# Altium schematic sheet EVK-IRIS-W1-FTDI.SchDoc
size A3; DocumentNumber: 9; SheetNumber: 9; SheetTotal: 14
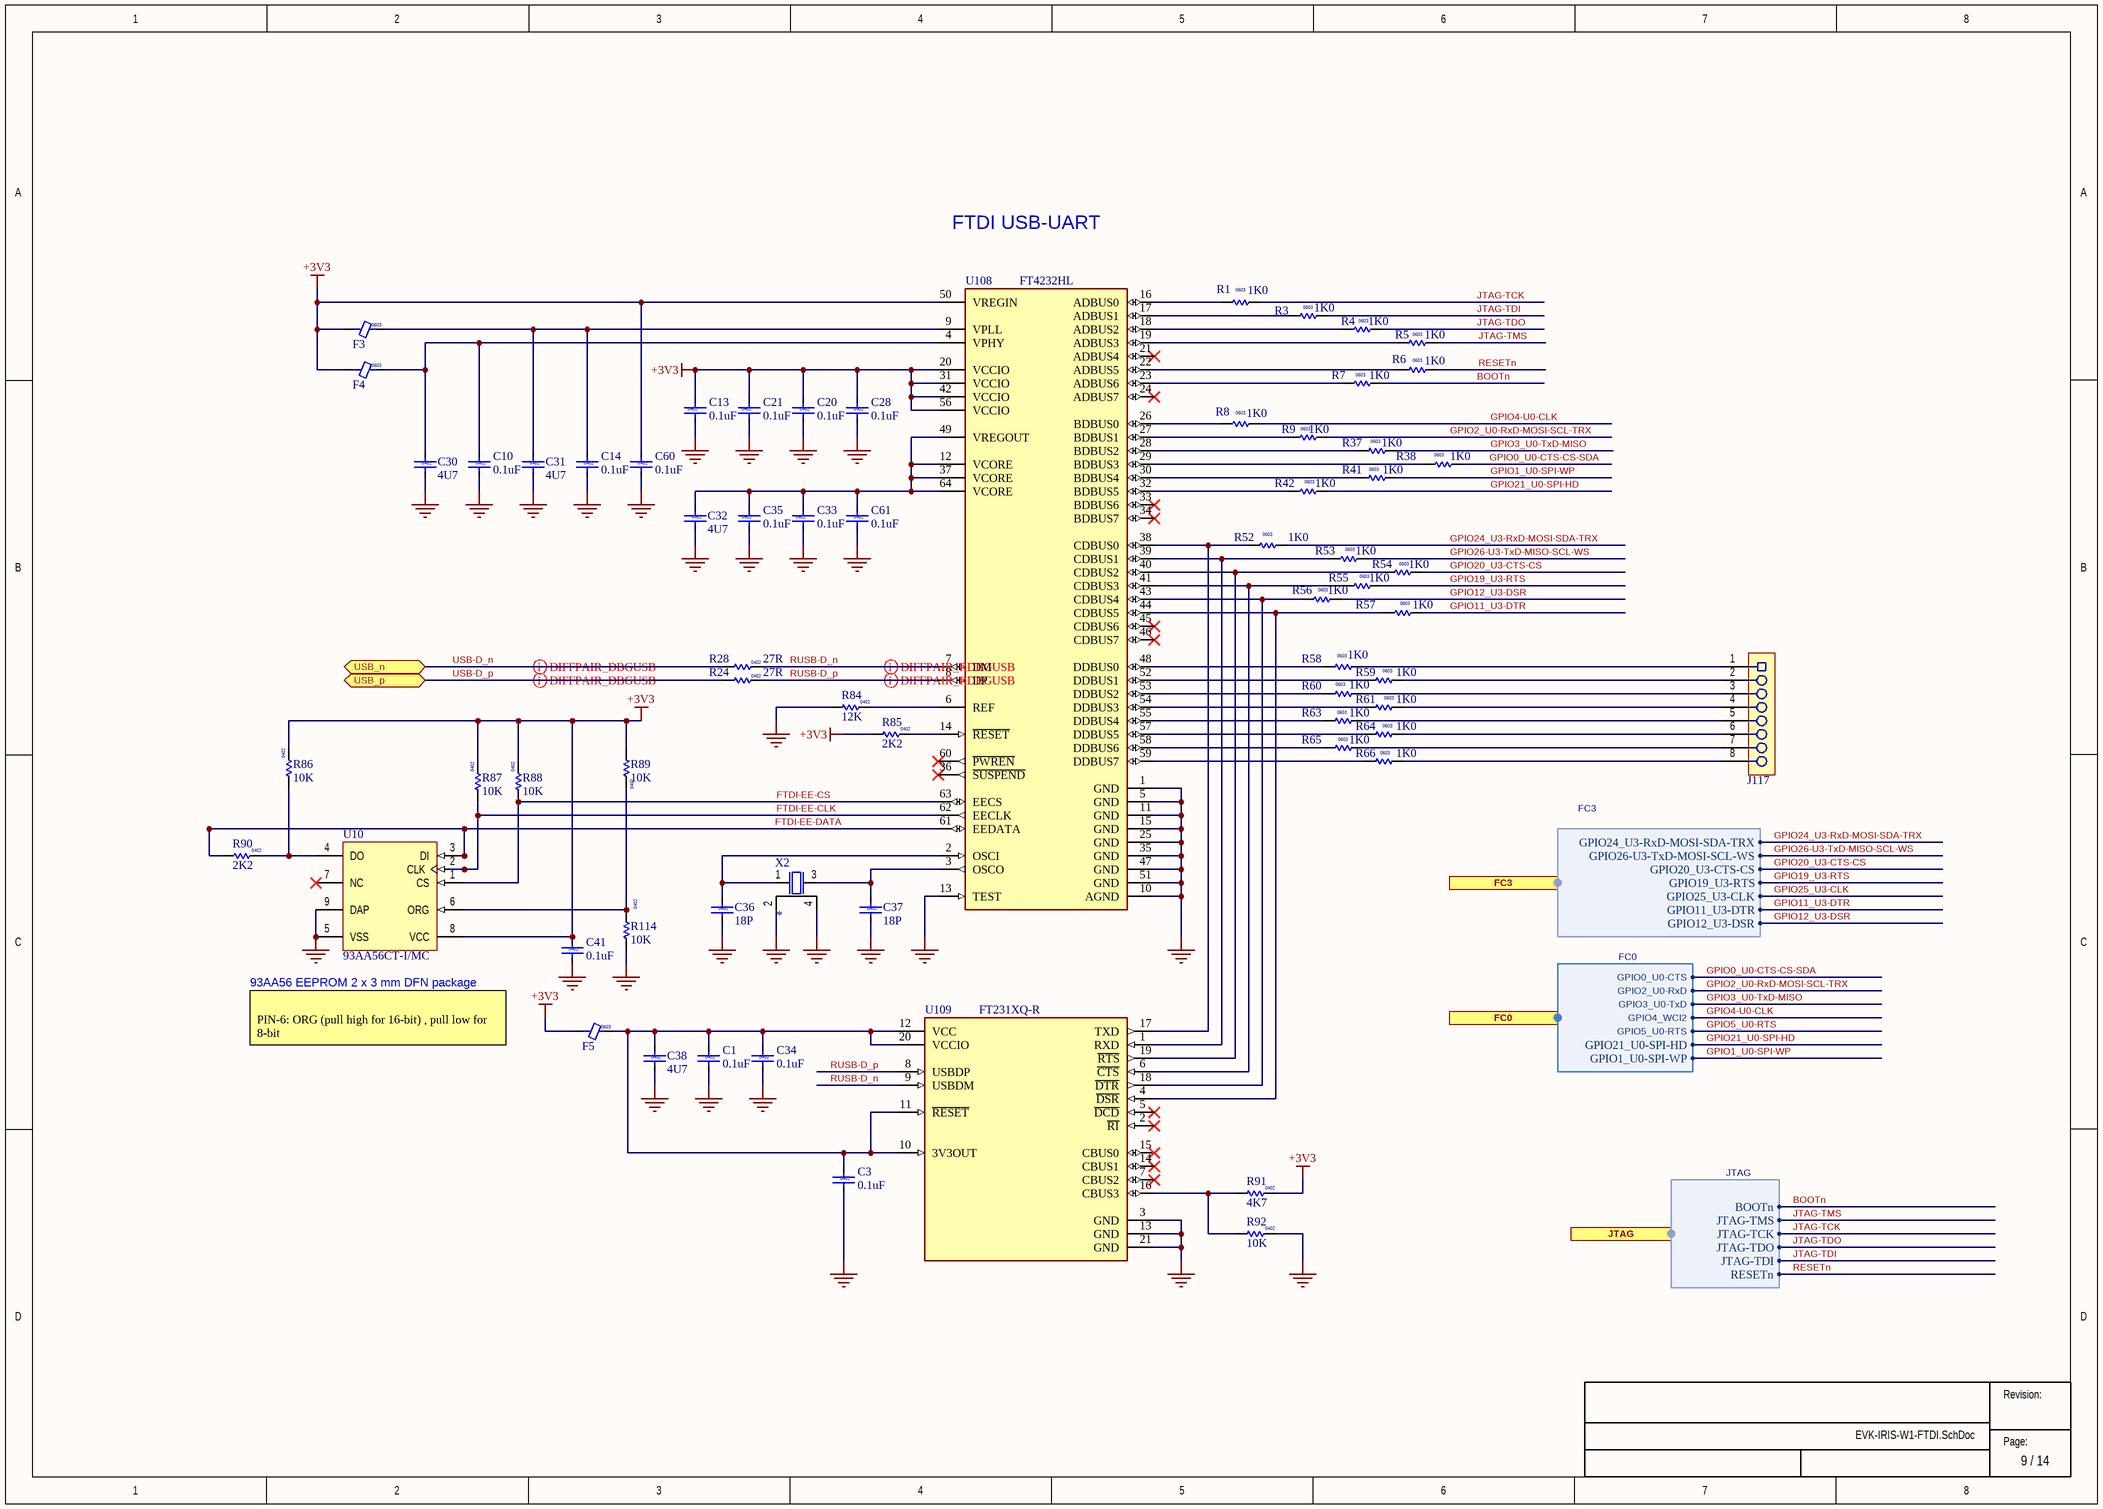
[diagram p0: EVK-IRIS-W1-FTDI.SchDoc]

## Parts
C1  value 0.1uF  Size: 0402  [Cap 0402 HD]
C3  value 0.1uF  Size: 0402  [Cap 0402 HD]
C10  value 0.1uF  Size: 0402  [Cap 0402 HD]
C13  value 0.1uF  Size: 0402  [Cap 0402 HD]
C14  value 0.1uF  Size: 0402  [Cap 0402 HD]
C20  value 0.1uF  Size: 0402  [Cap 0402 HD]
C21  value 0.1uF  Size: 0402  [Cap 0402 HD]
C28  value 0.1uF  Size: 0402  [Cap 0402 HD]
C30  value 4U7  Size: 0402  [Cap 0402 HD]
C31  value 4U7  Size: 0402  [Cap 0402 HD]
C32  value 4U7  Size: 0402  [Cap 0402 HD]
C33  value 0.1uF  Size: 0402  [Cap 0402 HD]
C34  value 0.1uF  Size: 0402  [Cap 0402 HD]
C35  value 0.1uF  Size: 0402  [Cap 0402 HD]
C36  value 18P  Size: 0402  [Cap 0402]
C37  value 18P  Size: 0402  [Cap 0402]
C38  value 4U7  Size: 0402  [Cap 0402 HD]
C41  value 0.1uF  Size: 0402  [Cap 0402 HD]
C60  value 0.1uF  Size: 0402  [Cap 0402 HD]
C61  value 0.1uF  Size: 0402  [Cap 0402 HD]
F3  Size: 0603  [IND 0603 HD]
F4  Size: 0603  [IND 0603 HD]
F5  Size: 0603  [IND 0603 HD]
J117  (no value)  [SKT-0.1P-SSM-108-L-SV]
R1  value 1K0  Size: 0603  [RES 0603 HD]
R3  value 1K0  Size: 0603  [RES 0603 HD]
R4  value 1K0  Size: 0603  [RES 0603 HD]
R5  value 1K0  Size: 0603  [RES 0603 HD]
R6  value 1K0  Size: 0603  [RES 0603 HD]
R7  value 1K0  Size: 0603  [RES 0603 HD]
R8  value 1K0  Size: 0603  [RES 0603 HD]
R9  value 1K0  Size: 0603  [RES 0603 HD]
R24  value 27R  Size: 0402  [RES 0402 HD]
R28  value 27R  Size: 0402  [RES 0402 HD]
R37  value 1K0  Size: 0603  [RES 0603 HD]
R38  value 1K0  Size: 0603  [RES 0603 HD]
R41  value 1K0  Size: 0603  [RES 0603 HD]
R42  value 1K0  Size: 0603  [RES 0603 HD]
R52  value 1K0  Size: 0603  [RES 0603 HD]
R53  value 1K0  Size: 0603  [RES 0603 HD]
R54  value 1K0  Size: 0603  [RES 0603 HD]
R55  value 1K0  Size: 0603  [RES 0603 HD]
R56  value 1K0  Size: 0603  [RES 0603 HD]
R57  value 1K0  Size: 0603  [RES 0603 HD]
R58  value 1K0  Size: 0603  [RES 0603 HD]
R59  value 1K0  Size: 0603  [RES 0603 HD]
R60  value 1K0  Size: 0603  [RES 0603 HD]
R61  value 1K0  Size: 0603  [RES 0603 HD]
R63  value 1K0  Size: 0603  [RES 0603 HD]
R64  value 1K0  Size: 0603  [RES 0603 HD]
R65  value 1K0  Size: 0603  [RES 0603 HD]
R66  value 1K0  Size: 0603  [RES 0603 HD]
R84  value 12K  Size: 0402  [RES 0402 HD]
R85  value 2K2  Size: 0402  [RES 0402 HD]
R86  value 10K  Size: 0402  [RES 0402 HD]
R87  value 10K  Size: 0402  [RES 0402 HD]
R88  value 10K  Size: 0402  [RES 0402 HD]
R89  value 10K  Size: 0402  [RES 0402 HD]
R90  value 2K2  Size: 0402  [RES 0402 HD]
R91  value 4K7  Size: 0402  [RES 0402 HD]
R92  value 10K  Size: 0402  [RES 0402 HD]
R114  value 10K  Size: 0402  [RES 0402 HD]
U10  93AA56CT-I/MC  [DFN-MC8]
U108  FT4232HL  [QFP0.5P16x16-64Pin_HD]
U109  FT231XQ-R  [QFN_5x5_FT231XQ]
X2  (no value)  [XTAL_3225]

## Ports
FC0 (harness FC0), FC3 (harness FC3), JTAG (harness JTAG), USB_n (bidir), USB_p (bidir)

## Harnesses
JTAG: JTAG-TCK, JTAG-TDI, JTAG-TDO, JTAG-TMS, RESETn, BOOTn
FC3: GPIO20_U3-CTS-CS, GPIO19_U3-RTS, GPIO24_U3-RxD-MOSI-SDA-TRX, GPIO26-U3-TxD-MOSI-SCL-WS, GPIO25_U3-CLK, GPIO11_U3-DTR, GPIO12_U3-DSR
FC0: GPIO0_U0-CTS, GPIO2_U0-RxD, GPIO3_U0-TxD, GPIO5_U0-RTS, GPIO4_WCI2, GPIO21_U0-SPI-HD, GPIO1_U0-SPI-WP

## Nets
+3V3: C13.1 C20.1 C21.1 C28.1 C41.1 C60.1 F3.1 F4.1 F5.1 R85.1 R86.2 R87.2 R88.2 R89.1 R91.2 U10.8(VCC) U108.20(VCCIO) U108.31(VCCIO) U108.42(VCCIO) U108.50(VREGIN) U108.56(VCCIO)
GND: C1.2 C3.2 C10.2 C13.2 C14.2 C20.2 C21.2 C28.2 C30.2 C31.2 C32.2 C33.2 C34.2 C35.2 C36.2 C37.2 C38.2 C41.2 C60.2 C61.2 R84.1 R92.2 R114.1 U10.5(VSS) U10.9(DAP) U108.1(GND) U108.5(GND) U108.10(AGND) U108.11(GND) U108.13(TEST) U108.15(GND) U108.25(GND) U108.35(GND) U108.47(GND) U108.51(GND) U109.3(GND) U109.13(GND) U109.21(GND) X2.2 X2.4
BOOTn: R7.2 ; port JTAG.BOOTn
FTDI-EE-CLK: R87.1 U10.2(CLK) U108.62(EECLK)
FTDI-EE-CS: R88.1 U10.1(CS) U108.63(EECS)
FTDI-EE-DATA: R90.1 U10.3(DI) U108.61(EEDATA)
GPIO0_U0-CTS-CS-SDA: R38.2 ; port FC0.GPIO0_U0-CTS
GPIO1_U0-SPI-WP: R41.2 ; port FC0.GPIO1_U0-SPI-WP
GPIO2_U0-RxD-MOSI-SCL-TRX: R9.2 ; port FC0.GPIO2_U0-RxD
GPIO3_U0-TxD-MISO: R37.2 ; port FC0.GPIO3_U0-TxD
GPIO4-U0-CLK: R8.2 ; port FC0.GPIO4_WCI2
GPIO11_U3-DTR: R57.2 ; port FC3.GPIO11_U3-DTR
GPIO12_U3-DSR: R56.2 ; port FC3.GPIO12_U3-DSR
GPIO19_U3-RTS: R55.2 ; port FC3.GPIO19_U3-RTS
GPIO20_U3-CTS-CS: R54.2 ; port FC3.GPIO20_U3-CTS-CS
GPIO21_U0-SPI-HD: R42.2 ; port FC0.GPIO21_U0-SPI-HD
GPIO24_U3-RxD-MOSI-SDA-TRX: R52.2 ; port FC3.GPIO24_U3-RxD-MOSI-SDA-TRX
GPIO25_U3-CLK: port FC3.GPIO25_U3-CLK
GPIO26-U3-TxD-MISO-SCL-WS: R53.2 ; port FC3.GPIO26-U3-TxD-MOSI-SCL-WS
JTAG-TCK: R1.2 ; port JTAG.JTAG-TCK
JTAG-TDI: R3.2 ; port JTAG.JTAG-TDI
JTAG-TDO: R4.2 ; port JTAG.JTAG-TDO
JTAG-TMS: R5.2 ; port JTAG.JTAG-TMS
RESETn: R6.2 ; port JTAG.RESETn
RUSB-D_n: R28.1 U108.7(DM) U109.9(USBDM)
RUSB-D_p: R24.1 U108.8(DP) U109.8(USBDP)
USB-D_n: R28.2 ; port USB_n
USB-D_p: R24.2 ; port USB_p
NetC1_1: C1.1 C3.1 C34.1 C38.1 F5.2 U109.10(3V3OUT) U109.11(~{RESET}) U109.12(VCC) U109.20(VCCIO)
NetC10_1: C10.1 C30.1 F4.2 U108.4(VPHY)
NetC14_1: C14.1 C31.1 F3.2 U108.9(VPLL)
NetC32_1: C32.1 C33.1 C35.1 C61.1 U108.12(VCORE) U108.37(VCORE) U108.49(VREGOUT) U108.64(VCORE)
NetC36_1: C36.1 U108.2(OSCI) X2.1
NetC37_1: C37.1 U108.3(OSCO) X2.3
NetJ117_1: J117.1 R58.2
NetJ117_2: J117.2 R59.2
NetJ117_3: J117.3 R60.2
NetJ117_4: J117.4 R61.2
NetJ117_5: J117.5 R63.2
NetJ117_6: J117.6 R64.2
NetJ117_7: J117.7 R65.2
NetJ117_8: J117.8 R66.2
NetR1_1: R1.1 U108.16(ADBUS0)
NetR3_1: R3.1 U108.17(ADBUS1)
NetR4_1: R4.1 U108.18(ADBUS2)
NetR5_1: R5.1 U108.19(ADBUS3)
NetR6_1: R6.1 U108.22(ADBUS5)
NetR7_1: R7.1 U108.23(ADBUS6)
NetR8_1: R8.1 U108.26(BDBUS0)
NetR9_1: R9.1 U108.27(BDBUS1)
NetR37_1: R37.1 U108.28(BDBUS2)
NetR38_1: R38.1 U108.29(BDBUS3)
NetR41_1: R41.1 U108.30(BDBUS4)
NetR42_1: R42.1 U108.32(BDBUS5)
NetR52_1: R52.1 U108.38(CDBUS0) U109.17(TXD)
NetR53_1: R53.1 U108.39(CDBUS1) U109.1(RXD)
NetR54_1: R54.1 U108.40(CDBUS2) U109.19(~{RTS})
NetR55_1: R55.1 U108.41(CDBUS3) U109.6(~{CTS})
NetR56_1: R56.1 U108.43(CDBUS4) U109.18(~{DTR})
NetR57_1: R57.1 U108.44(CDBUS5) U109.4(~{DSR})
NetR58_1: R58.1 U108.48(DDBUS0)
NetR59_1: R59.1 U108.52(DDBUS1)
NetR60_1: R60.1 U108.53(DDBUS2)
NetR61_1: R61.1 U108.54(DDBUS3)
NetR63_1: R63.1 U108.55(DDBUS4)
NetR64_1: R64.1 U108.57(DDBUS5)
NetR65_1: R65.1 U108.58(DDBUS6)
NetR66_1: R66.1 U108.59(DDBUS7)
NetR84_2: R84.2 U108.6(REF)
NetR85_2: R85.2 U108.14(~{RESET})
NetR86_1: R86.1 R90.2 U10.4(DO)
NetR89_2: R89.2 R114.2 U10.6(ORG)
NetR91_1: R91.1 R92.1 U109.16(CBUS3)

Not connected (* = marked no-connect by the designer): U10 7(NC)*; U108 21(ADBUS4)* 24(ADBUS7)* 33(BDBUS6)* 34(BDBUS7)* 36(~{SUSPEND})* 45(CDBUS6)* 46(CDBUS7)* 60(~{PWREN})*; U109 2(~{RI})* 5(~{DCD})* 7(CBUS2)* 14(CBUS1)* 15(CBUS0)*

## Layout directives
differential pair; differential pair class USB_DIFF; net class USB_DIFF: RUSB-D_n, RUSB-D_p, USB-D_p
differential pair; net class USB_DIFF; differential pair class USB_DIFF: USB-D_n

## Notes on the sheet
- FTDI USB-UART
- (near U10) 93AA56 EEPROM 2 x 3 mm DFN package
- PIN-6: ORG (pull high for 16-bit) , pull low for 8-bit
- Revision:
- Page:

## Library data of the parts
C1 C3 C10 C13 C14 C20 C21 C28 C33-C35 C41 C60 C61 = 120-00016: Cap, Ceramic 0.1uF 10V 10% X5R 0402; Part Name: CAP CER 0.1UF 10V 10% X5R 0402; Manufacturer 1: Murata Electronics North America; Manufacturer Part Number 1: GRM155R61A104KA01J; Tolerance: +/- 10%; Use in new designs: Yes; UBX Code: None; Item Phase: In Production; Part Number: 120-00016; Revision: 0A; Supplier 1: Digi-Key; Supplier Part Number 1: 490-6297-1-ND; Manufacturer 2: Yageo; Supplier 2: Digi-Key; Supplier Part Number 2: 311-1336-1-ND; Height: 0.55mm; Pins: 2; Temperature Coefficient: X5R; Voltage: 10V; Max Operating Temp: 85; Manufacturer Part Number 2: CC0402KRX5R6BB104; Min Operating Temp: -55
C30-C32 C38 = UBXH01-0000243: CAP CER X5R 0402 4U7 20% 10V; Manufacturer: Murata Manufacturing Company, Ltd.; Manufacturer P/N: GRM155R61A475MEAA; Editor: martin.pilik; Released by: fabrice.bret-dibat; Env: GREEN; Permitted Use: Volume Products; Perferred: PREF; Mfg P/N Status: Active; Mfg P/N Split: 100; Mfg P/N Released: Yes; Part Number: UBXH01-0000243; Tolerance: 20%; Max Voltage: 10V; Min Operating Temp: -40°C; Max Operating Temp: 85°C; Part Type: Capacitor; Release Data: 2021-05-10T12:57:47; UBX Wiki: https://wiki.u-blox.com/bin/view/Operations/PartDetails?index=24303; RefDes: C; Mfg P/N Datasheet: https://wiki.u-blox.com/bin/view/Generic/Docs/DocumentSummary?index=24302
C36 C37 = UBXH01-0004017: CAP CER C0G 0402 18P 5% 25V; Manufacturer: Murata Manufacturing Company, Ltd.; Manufacturer P/N: GRM1555C1H180JA01; Editor: doris.zahnd; Released by: daniel.hurni; Env: ROHS; Permitted Use: Volume Products; Perferred: PREF; Mfg P/N Status: NRND; Mfg P/N Split: 100; Mfg P/N Released: Yes; Part Number: UBXH01-0004017; Tolerance: 5%; Max Voltage: 25V; Min Operating Temp: -55°C; Max Operating Temp: 125°C; Part Type: Capacitor; Release Data: 2009-12-03T17:48:42; UBX Wiki: https://wiki.u-blox.com/bin/view/Operations/PartDetails?index=5178; RefDes: C; Manufacturer 2: Murata Manufacturing Company, Ltd.; Manufacturer P/N 2: GRM1555C1E180JZ01; Mfg P/N Status 2: Obsolete; Mfg P/N Split 2: 0; Mfg P/N Released 2: Yes; Manufacturer 3: Murata Manufacturing Company, Ltd.; Manufacturer P/N 3: GRM1555C1H180JZ01; Mfg P/N Status 3: Obsolete; Mfg P/N Split 3: 0; Mfg P/N Released 3: Yes
F3-F5 = UBXH08-0000001: FERRITE BEAD 0603 600 OHM AT 100MHZ 600OHM 500mA; Manufacturer: TDK Corporation; Manufacturer P/N: MMZ1608B601C; Editor: daniel.hurni; Released by: martin.frauchiger; Env: ROHS; Permitted Use: Support Products; Perferred: PREF; Mfg P/N Status: Active; Mfg P/N Split: 100; Mfg P/N Released: Yes; Part Number: UBXH08-0000001; Value: 600OHM; Max Current: 500mA; Min Operating Temp: -40°C; Max Operating Temp: 125°C; Part Type: Ferrite; Release Data: 2009-12-02T10:18:36; UBX Wiki: https://wiki.u-blox.com/bin/view/Operations/PartDetails?index=7960; RefDes: FB; Mfg P/N Datasheet: https://wiki.u-blox.com/bin/view/Generic/Docs/DocumentSummary?index=7941
J117 = 130-00102: Socket Strip 0.1" 8 Pin 1Row SMD Black; Manufacturer 1: Samtec; Manufacturer Part Number 1: SSM-108-F-SV-P-TR; Part Name: CON SKT Strip 0.1" 8Pin 1Row SMD Black; Item Phase: In Production; Use in new designs: Yes; Voltage: 572VDC; UBX Code: None; Part Number: 130-00102; Supplier 1: Avnet; Supplier Part Number 1: SSM-108-F-SV-P-TR; Diameter: None; Height: 7.37mm; Max Operating Temp: 105; Min Operating Temp: -55; Pins: 8; Revision: 0D; Manufacturer 2: Sullins Connector Solutions; Manufacturer Part Number 2: NPPC081KFXC-RC; Supplier 2: Digi-Key; Supplier Part Number 2: S5639-ND
R1 R3-R9 R37 R38 R41 R42 R52-R61 R63-R66 = UBXH18-0000400: RES THICK FILM CHIP 0603 25PPM 1K0 0.1% 100mW; Manufacturer: YAGEO; Manufacturer P/N: RT0603BRD071KL; Editor: martin.kessel; Env: ROHS; Permitted Use: Internal Use; Perferred: PREF; Mfg P/N Status: Active; Mfg P/N Split: 100; Mfg P/N Released: No; Part Number: UBXH18-0000400; Tolerance: 0.1%; Max Power: 100mW; Part Type: Resistor; UBX Wiki: https://wiki.u-blox.com/bin/view/Operations/PartDetails?index=27323; RefDes: R; Min Operating Temp: -55°C; Max Operating Temp: 155°C
R24 R28 = 180-00125: Resistor, 27ohm, 1%, 1/16W, 0402; Part Name: RES SMD 27 OHM 1% 1/16W 0402; Manufacturer 1: Panasonic Electronic Components; Manufacturer Part Number 1: ERJ-2RKF27R0X; Tolerance: +/- 1%; Use in new designs: Yes; UBX Code: None; Item Phase: In Production; Part Number: 180-00125; Supplier 1: Digi-Key; Supplier Part Number 1: P27.0LCT-ND; Height: 0.4mm; Pins: 2; Power: 1/16W; Revision: 0C; Manufacturer 2: Yageo; Supplier 2: Digi-Key; Supplier Part Number 2: YAG3086CT-ND; Max Operating Temp: 155; Voltage: None; Manufacturer Part Number 2: RC0402FR-0727RL; Min Operating Temp: -55
R84 = UBXH18-0000137: RES THICK FILM CHIP 0402 12K 1% 63mW; Manufacturer: Vishay; Manufacturer P/N: CRCW040212K0FKED; Editor: matej.budin; Released by: gabriele.capello; Env: ROHS; Permitted Use: Support Products; Perferred: PREF; Mfg P/N Status: Active; Mfg P/N Split: 100; Mfg P/N Released: Yes; Part Number: UBXH18-0000137; Tolerance: 1%; Max Power: 63mW; Min Operating Temp: -55°C; Max Operating Temp: 125°C; Part Type: Resistor; Release Data: 2014-08-26T10:20:00; UBX Wiki: https://wiki.u-blox.com/bin/view/Operations/PartDetails?index=21075; RefDes: R; Mfg P/N Datasheet: https://wiki.u-blox.com/bin/view/Generic/Docs/DocumentSummary?index=21077
R85 R90 = UBXH18-0008057: RES THICK FILM CHIP 0402 2K2 5% 100mW; Manufacturer: YAGEO; Manufacturer P/N: 2322_705_87222_L; Editor: roland.rust; Env: ROHS; Permitted Use: Volume Products; Perferred: PREF; Mfg P/N Status: NRND; Mfg P/N Split: 100; Mfg P/N Released: Yes; Part Number: UBXH18-0008057; Tolerance: 5%; Max Power: 100mW; Part Type: Resistor; Released by: roland.rust; Release Data: 2007-02-09T10:46:57; UBX Wiki: https://wiki.u-blox.com/bin/view/Operations/PartDetails?index=6956; RefDes: R; Manufacturer 2: YAGEO; Manufacturer P/N 2: RC0402JR-072K2L; Mfg P/N Status 2: Active; Mfg P/N Split 2: 0; Mfg P/N Released 2: Yes; Mfg P/N Datasheet 2: https://wiki.u-blox.com/bin/view/Generic/Docs/DocumentSummary?index=8163
R86-R89 R92 R114 = UBXH18-0008073: RES THICK FILM CHIP 0402 10K 5% 100mW; Manufacturer: KOA; Manufacturer P/N: RK73B1ETTD103J; Editor: martin.frauchiger; Env: ROHS; Permitted Use: Volume Products; Perferred: PREF; Mfg P/N Status: NRND; Mfg P/N Split: 100; Mfg P/N Released: Yes; Part Number: UBXH18-0008073; Tolerance: 5%; Max Power: 100mW; Part Type: Resistor; Released by: martin.frauchiger; Release Data: 2005-08-19T10:42:45; UBX Wiki: https://wiki.u-blox.com/bin/view/Operations/PartDetails?index=6981; RefDes: R; Manufacturer 2: YAGEO; Manufacturer P/N 2: RC0402JR-0710KL; Mfg P/N Status 2: Active; Mfg P/N Split 2: 0; Mfg P/N Released 2: No; Manufacturer 3: YAGEO; Manufacturer P/N 3: 2322_705_87103_L; Mfg P/N Status 3: NRND; Mfg P/N Split 3: 0; Mfg P/N Released 3: Yes
R91 = UBXH18-0008065: RES THICK FILM CHIP 0402 4K7 5% 100mW; Manufacturer: YAGEO; Manufacturer P/N: 2322_705_70472_L; Editor: martin.frauchiger; Env: ROHS; Permitted Use: Volume Products; Perferred: PREF; Mfg P/N Status: NRND; Mfg P/N Split: 100; Mfg P/N Released: Yes; Part Number: UBXH18-0008065; Tolerance: 5%; Max Power: 100mW; Part Type: Resistor; Released by: martin.frauchiger; Release Data: 2005-08-19T10:42:45; UBX Wiki: https://wiki.u-blox.com/bin/view/Operations/PartDetails?index=6969; RefDes: R; Manufacturer 2: KOA; Manufacturer P/N 2: RK73B1ETTD472J; Mfg P/N Status 2: NRND; Mfg P/N Split 2: 0; Mfg P/N Released 2: Yes
U10 = CMP-0162-00287-1: 2K, 256x8 or 128x16-bit, 1.8V Microwire Serial EEPROM, 8-Pin DFN, Industrial Temperature, Tape and Reel; Manufacturer: Microchip; PackageReference: DFN-MC8; PackageVersion: revBB, Aug-2009; DatasheetVersion: revF, May-2008; PackageDescription: 8-Lead Plastic Dual Flat, No Lead Package (MC) - 2x3x0.9mm Body [DFN]; Manufacturer P/N: 93AA56CT-I/MC; Part type: EEPROM IC
U108 = UBXH10-0000092: FTDI FT4232HL QUAD HIGH SPEED USB TO MULTIPURPOSE UART LQFP-64; Manufacturer: FTDI Future Technology Devices International; Editor: olof.viklund; Released by: aneeb.sohail; Env: ROHS; Permitted Use: Support Products; Perferred: PREF; Mfg P/N Status: Active; Mfg P/N Split: 100; Mfg P/N Released: No; Part Number: UBXH10-0000092; Value: FT4232HL; Min Operating Temp: -40°C; Max Operating Temp: 85°C; Part Type: Interface; Release Data: 2021-08-27T14:44:23; UBX Wiki: https://wiki.u-blox.com/bin/view/Operations/PartDetails?index=35482; RefDes: U; Manufacturer P/N: FT4232HL; Mfg P/N Datasheet: https://wiki.u-blox.com/bin/view/Generic/Docs/DocumentSummary?index=16016
U109 = UBXH10-0000054: FTDI USB TO SERIAL FULL UART INTERFACE QFN20; Manufacturer: FTDI Future Technology Devices International; Editor: adam.johansson; Env: ROHS; Permitted Use: Support Products; Perferred: PREF; Mfg P/N Status: Active; Mfg P/N Split: 100; Mfg P/N Released: Yes; Released by: jaka.bevk; Part Number: UBXH10-0000054; Value: FT231XQ-R; Min Operating Temp: -40°C; Max Operating Temp: 85°C; Part Type: Interface; UBX Wiki: https://wiki.u-blox.com/bin/view/Operations/PartDetails?index=27258; RefDes: U; Manufacturer P/N: FT231XQ-R; Mfg P/N Datasheet: https://wiki.u-blox.com/bin/view/Generic/Docs/DocumentSummary?index=33707; Release Data: 2022-03-08T12:58:15
X2 = 100-00006: XTAL, 4Pin, 12.0000MHz, 18pF, 20ppm, 4Pins; Manufacturer 1: Abracon LLC; Manufacturer Part Number 1: ABM8-12.000MHZ-B2-T; Part Name: XTAL 12MHz 18pF 20ppm 3225; Body Size: 3.2mm x 2.5mm; Item Phase: Unreleased; MFG Package: 4-SMD; Use in new designs: Yes; Voltage: None; Value: *; Part Number: 100-00006; Supplier 1: Digi-Key; Supplier Part Number 1: 535-9826-1-ND; Manufacturer 2: AVX Corporation; Manufacturer Part Number 2: CX3225GB12000P0HPQCC; Supplier 2: Digi-Key; Supplier Part Number 2: 1253-1168-1-ND; Height: 0.8mm; Max Operating Temp: 75; Min Operating Temp: -20; Pins: 4; Revision: None; UBX Code: None